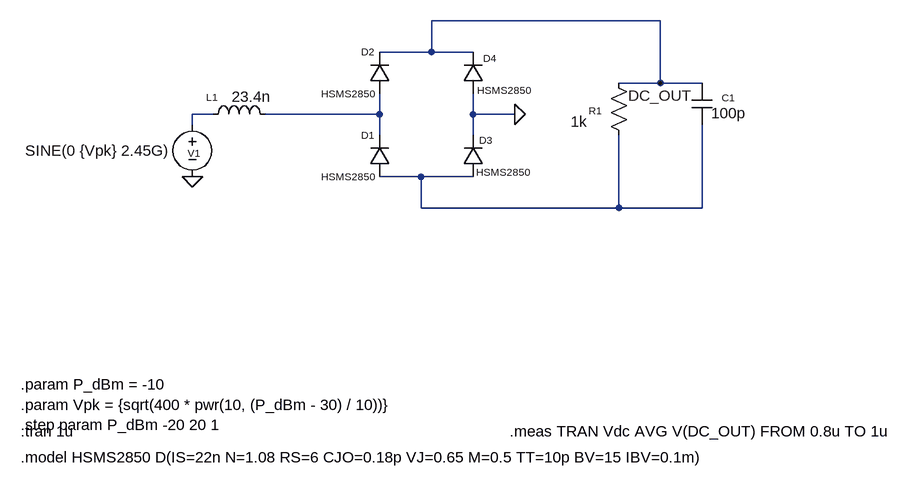
[diagram p0: schematic Full-wave_rectifier_sim.asc]
Full-wave_rectifier_sim.asc, the LTspice schematic file:
Version 4
SHEET 1 1052 864
WIRE 720 176 368 176
WIRE 368 224 368 176
WIRE 368 224 288 224
WIRE 432 224 368 224
WIRE 720 272 720 176
WIRE 720 272 656 272
WIRE 784 272 720 272
WIRE 32 320 0 320
WIRE 288 320 288 288
WIRE 288 320 112 320
WIRE 432 320 432 288
WIRE 496 320 432 320
WIRE 0 336 0 320
WIRE 288 352 288 320
WIRE 432 352 432 320
WIRE 352 416 288 416
WIRE 432 416 352 416
WIRE 352 464 352 416
WIRE 656 464 656 352
WIRE 656 464 352 464
WIRE 784 464 784 336
WIRE 784 464 656 464
FLAG 0 416 0
FLAG 720 272 DC_OUT
FLAG 496 320 0
SYMBOL voltage 0 320 R0
WINDOW 0 -7 60 Left 1
WINDOW 3 -257 56 Left 2
SYMATTR InstName V1
SYMATTR Value SINE(0 {Vpk} 2.45G)
SYMATTR SpiceLine Rser=50
SYMBOL Cap 768 272 R0
WINDOW 0 46 22 Left 1
WINDOW 3 30 46 Left 2
SYMATTR InstName C1
SYMATTR Value 100p
SYMBOL Res 640 256 R0
WINDOW 0 -30 58 Left 1
WINDOW 3 -58 75 Left 2
SYMATTR InstName R1
SYMATTR Value 1k
SYMBOL ind 16 336 R270
WINDOW 0 32 14 VTop 1
WINDOW 3 59 75 VBottom 2
SYMATTR InstName L1
SYMATTR Value 23.4n
SYMBOL Diode 304 416 R180
WINDOW 0 24 64 Left 1
WINDOW 3 24 0 Left 1
SYMATTR InstName D1
SYMATTR Value HSMS2850
SYMBOL Diode 304 288 R180
WINDOW 0 24 64 Left 1
WINDOW 3 24 0 Left 1
SYMATTR InstName D2
SYMATTR Value HSMS2850
SYMBOL Diode 448 416 R180
WINDOW 0 -14 56 Left 1
WINDOW 3 -71 7 Left 1
SYMATTR InstName D3
SYMATTR Value HSMS2850
SYMBOL Diode 448 288 R180
WINDOW 0 -20 54 Left 1
WINDOW 3 -72 5 Left 1
SYMATTR InstName D4
SYMATTR Value HSMS2850
TEXT -264 848 Left 2 !.model HSMS2850 D(IS=22n N=1.08 RS=6 CJO=0.18p VJ=0.65 M=0.5 TT=10p BV=15 IBV=0.1m)
TEXT -264 808 Left 2 !.tran 1u
TEXT -264 736 Left 2 !.param P_dBm = -10\n.param Vpk = {sqrt(400 * pwr(10, (P_dBm - 30) / 10))}\n.step param P_dBm -20 20 1
TEXT 488 808 Left 2 !.meas TRAN Vdc AVG V(DC_OUT) FROM 0.8u TO 1u

The netlist it stands for:
* Full-wave_rectifier_sim.asc
V1 N001 0 SINE(0 {Vpk} 2.45G) Rser=50
C1 DC_OUT N003 100p
R1 DC_OUT N003 1k
L1 N001 N002 23.4n
D1 N003 N002 HSMS2850
D2 N002 DC_OUT HSMS2850
D3 N003 0 HSMS2850
D4 0 DC_OUT HSMS2850
.model D D
.lib standard.dio
.model HSMS2850 D(IS=22n N=1.08 RS=6 CJO=0.18p VJ=0.65 M=0.5 TT=10p BV=15 IBV=0.1m)
.tran 1u
.param P_dBm = -10
.param Vpk = {sqrt(400 * pwr(10, (P_dBm - 30) / 10))}
.step param P_dBm -20 20 1
.meas TRAN Vdc AVG V(DC_OUT) FROM 0.8u TO 1u
.backanno
.end